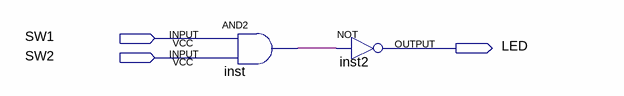
[diagram p0: schematic sheet]
// Quartus schematic PARTEA.bdf as structural Verilog: 2 symbols, 3 pins
module PARTEA (
  input  SW1,
  input  SW2,
  output LED
);

  wire inst_out;

  and inst (inst_out, SW1, SW2);
  not inst2 (LED, inst_out);
endmodule
